# EAGLE schematic esp8266 (EAGLE 6.1)
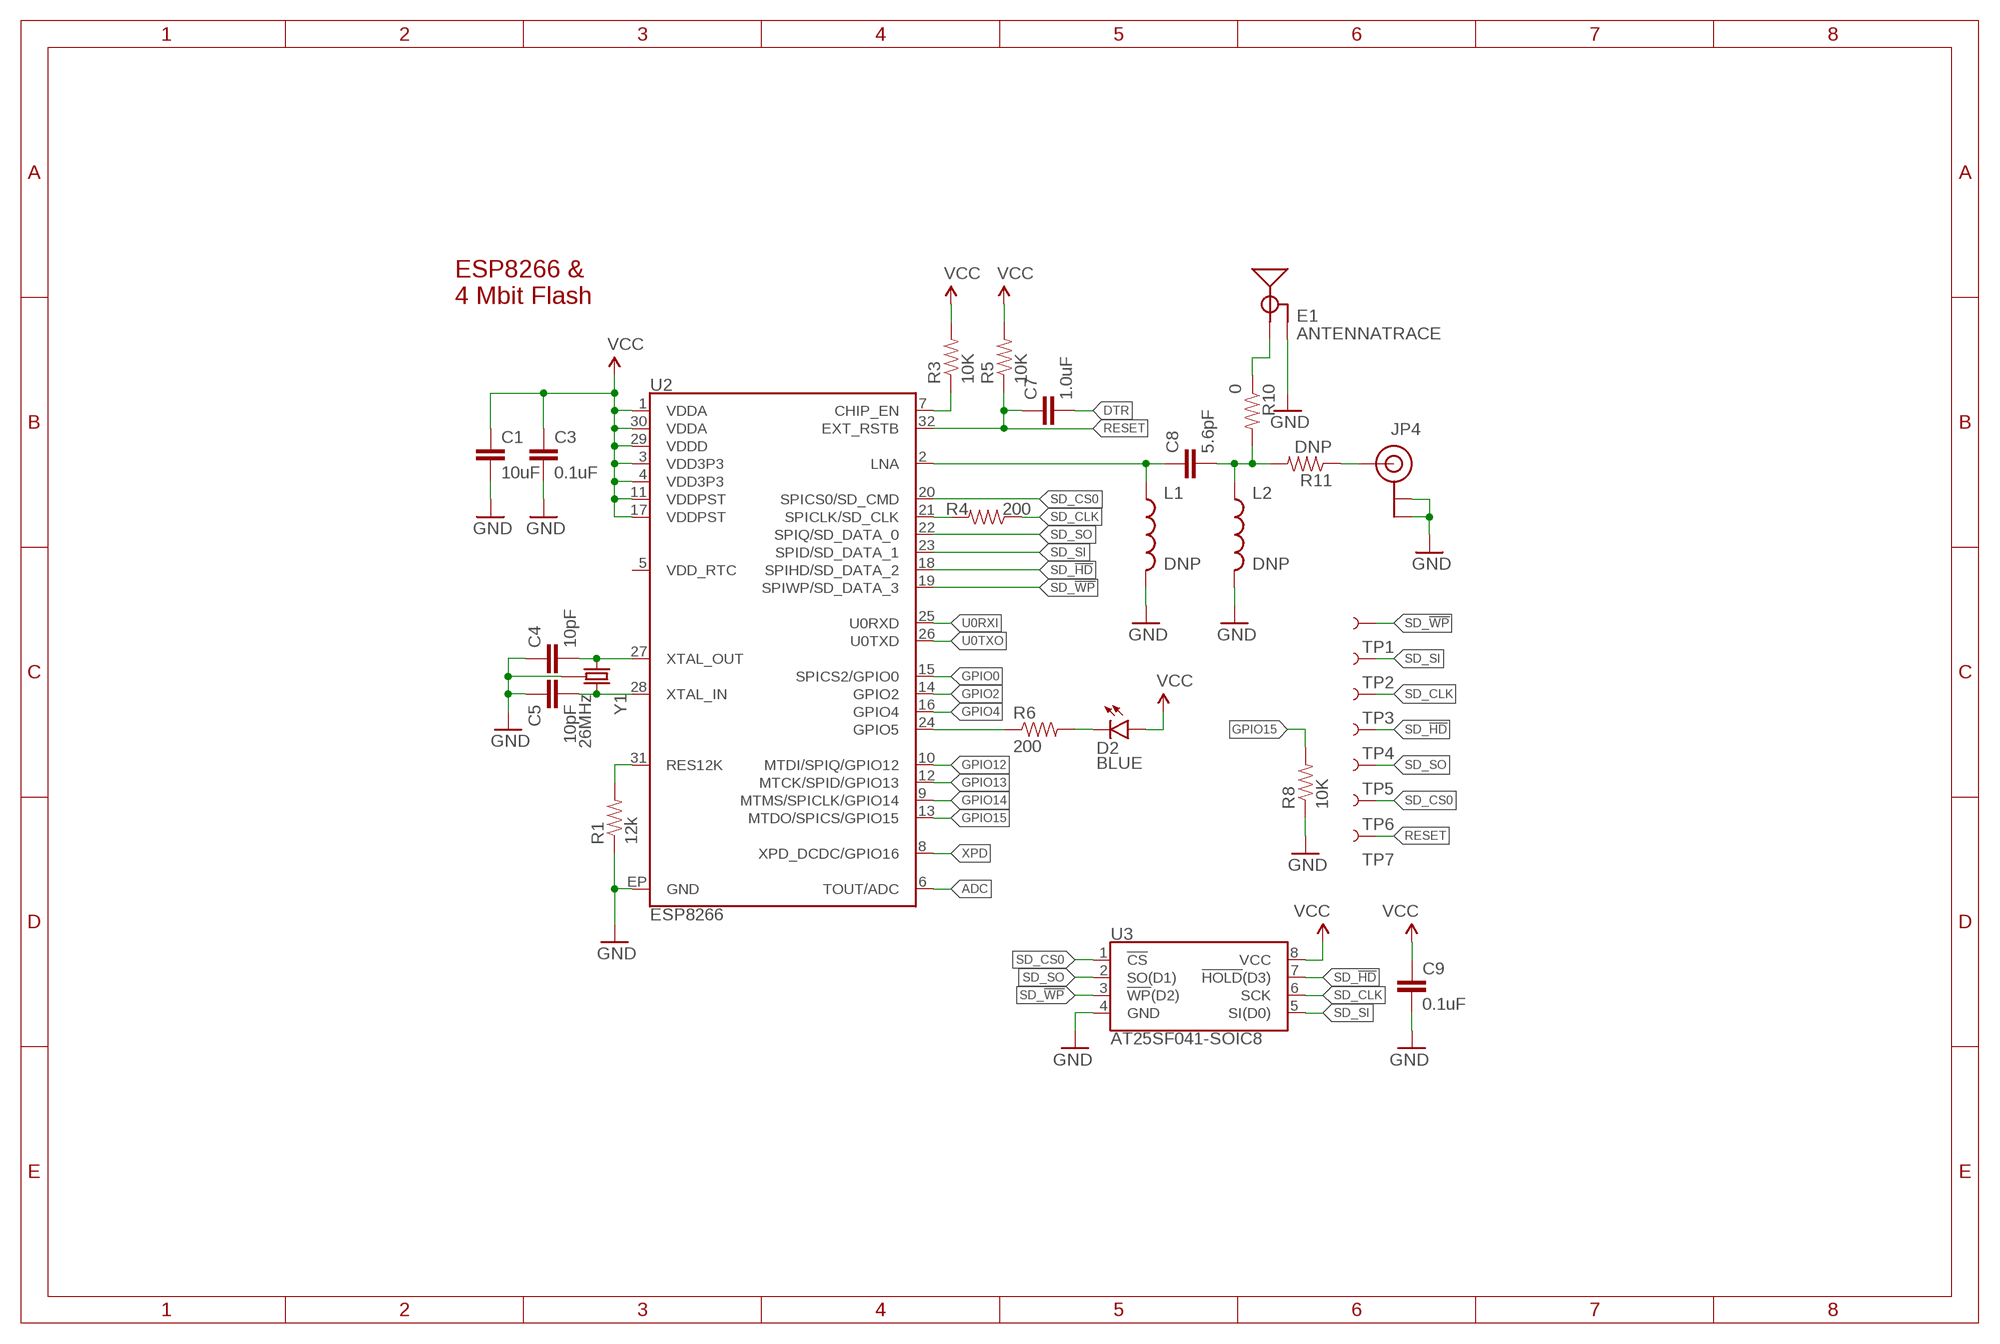
[diagram p0: schematic, sheet 1]

## Parts
C1  10uF  10UF-6.3V-20%(0603)  [0603-CAP]
C3  0.1uF  0.1UF-25V(+80/-20%)(0603)  [0603-CAP]
C4  10pF  10PF-50V-5%(0603)  [0603-CAP]
C5  10pF  10PF-50V-5%(0603)  [0603-CAP]
C7  1.0uF  1.0UF-16V-10%(0603)  [0603-CAP]
C8  5.6pF  CAP0603-CAP  [0603-CAP]
C9  0.1uF  0.1UF-25V(+80/-20%)(0603)  [0603-CAP]
D2  BLUE  LED-BLUE0603  [LED-0603]
E1  ANTENNATRACE  [TRACE_ANTENNA_2.4GHZ_25.7MM]
JP4  U.FL  [U.FL]
L1  DNP  INDUCTOR0603  [0603]
L2  DNP  INDUCTOR0603  [0603]
R1  12k  12KOHM-1/10W-1%(0603)  [0603-RES]
R3  10K  10KOHM1/10W1%(0603)0603  [0603-RES]
R4  200  200OHM1/10W1%(0603)  [0603-RES]
R5  10K  10KOHM1/10W1%(0603)0603  [0603-RES]
R6  200  200OHM1/10W1%(0603)  [0603-RES]
R8  10K  10KOHM1/10W1%(0603)0603  [0603-RES]
R10  0  0OHM1/10W5%(0603)  [0603]
R11  DNP  RESISTOR0603-RES  [0603-RES]
TP1  TEST-POINT3X5  [PAD.03X.05]
TP2  TEST-POINT3X5  [PAD.03X.05]
TP3  TEST-POINT3X5  [PAD.03X.05]
TP4  TEST-POINT3X5  [PAD.03X.05]
TP5  TEST-POINT3X5  [PAD.03X.05]
TP6  TEST-POINT3X5  [PAD.03X.05]
TP7  TEST-POINT3X5  [PAD.03X.05]
U2  ESP8266  [QFN32]
U3  AT25SF041-SOIC8  [SO08]
Y1  26MHz  CRYSTAL-GROUNDED3.2X2.5  [CRYSTAL-SMD-3.2X2.5]

## Nets
ADC: U2.6(TOUT/ADC)
ANT: JP4.P$3(SIGNAL) R11.1
CHIP_EN: R3.1 U2.7(CHIP_EN)
DTR: C7.2
GND: C1.2 C3.2 C4.1 C5.1 C9.2 E1.GND E1.GND2(GND) JP4.P$1(GND) JP4.P$2(GND) L1.2 L2.2 R1.1 R8.1 U2.EP(GND) U3.4(GND) Y1.2(GND) Y1.4(GND)
GPIO0: U2.15(SPICS2/GPIO0)
GPIO2: U2.14(GPIO2)
GPIO4: U2.16(GPIO4)
GPIO5: R6.1 U2.24(GPIO5)
GPIO12: U2.10(MTDI/SPIQ/GPIO12)
GPIO13: U2.12(MTCK/SPID/GPIO13)
GPIO14: U2.9(MTMS/SPICLK/GPIO14)
GPIO15: R8.2 U2.13(MTDO/SPICS/GPIO15)
LNA: C8.1 L1.1 U2.2(LNA)
N$1: R1.2 U2.31(RES12K)
N$2: C5.2 U2.28(XTAL_IN) Y1.3
N$3: C4.2 U2.27(XTAL_OUT) Y1.1
N$5: C8.2 L2.1 R10.2 R11.2
N$6: R4.2 U2.21(SPICLK/SD_CLK)
N$9: D2.C R6.2
RESET: C7.1 R5.1 TP7.P$1 U2.32(EXT_RSTB)
SD_!HD!: TP4.P$1 U2.18(SPIHD/SD_DATA_2) U3.7(!HOLD!(D3))
SD_!WP!: TP1.P$1 U2.19(SPIWP/SD_DATA_3) U3.3(!WP!(D2))
SD_CLK: R4.1 TP3.P$1 U3.6(SCK)
SD_CS0: TP6.P$1 U2.20(SPICS0/SD_CMD) U3.1(!CS!)
SD_SI: TP2.P$1 U2.23(SPID/SD_DATA_1) U3.5(SI(D0))
SD_SO: TP5.P$1 U2.22(SPIQ/SD_DATA_0) U3.2(SO(D1))
TRACE_ANT: E1.ANT(SIGNAL) R10.1
U0RXI: U2.25(U0RXD)
U0TXO: U2.26(U0TXD)
VCC: C1.1 C3.1 C9.1 D2.A R3.2 R5.2 U2.1(VDDA) U2.3(VDD3P3) U2.4(VDD3P3) U2.11(VDDPST) U2.17(VDDPST) U2.29(VDDD) U2.30(VDDA) U3.8(VCC)
XPD: U2.8(XPD_DCDC/GPIO16)
Unconnected: U2.5(VDD_RTC)

## Notes on the sheet
- ESP8266 &
  4 Mbit Flash

## Library data of the parts
C1 = SparkFun-Capacitors:10UF-6.3V-20%(0603): CAP-11015; PROD_ID: CAP-11015
C3 C9 = SparkFun-Capacitors:0.1UF-25V(+80/-20%)(0603): CAP-00810 Ceramic Standard decoupling cap; PROD_ID: CAP-00810
C4 C5 = SparkFun-Capacitors:10PF-50V-5%(0603): CAP-11812; PROD_ID: CAP-11812
C7 = SparkFun-Capacitors:1.0UF-16V-10%(0603): CAP-00868; PROD_ID: CAP-00868
C8 = SparkFun-Capacitors:CAP: Capacitor Standard 0603 ceramic capacitor, and 0.1" leaded capacitor.; PROD_ID: CAP-12456
D2 = SparkFun-LED:LED-BLUE: Blue LEDs for production use Various blue LEDs stocked by SparkFun production 0603 - DIO-08575 Rebel - DIO-09553 1206 - DIO-09911; PROD_ID: DIO-08575
E1 = esp8266-development-board:ANTENNA: Chip antenna Chip antenna with ground or secondary connection. Common with larger metal RF connectors.
JP4 = SparkFun-Connectors:U.FL: SMD antenna connector- WRL-09144; PROD_ID: CONN-09193
L1 L2 = SparkFun-Passives:INDUCTOR: Inductors Basic Inductor/Choke - 0603 and 1206. Footprints are not proven and vary greatly between part numbers. SRN6045- 33uH, 20% 1.4A SDR0403-560KL - 56uH, 10%, 500mA RMS/740mA peak
R1 = SparkFun-Resistors:12KOHM-1/10W-1%(0603): RES-10327; PROD_ID: RES-10327
R3 R5 R8 = SparkFun-Resistors:10KOHM1/10W1%(0603): RES-00824; PROD_ID: RES-00824
R4 R6 = SparkFun-Resistors:200OHM1/10W1%(0603): RES-08220; PROD_ID: RES-08220
R10 = SparkFun-Resistors:0OHM1/10W5%(0603): RES-08609; PROD_ID: RES-08609
R11 = SparkFun-Passives:RESISTOR: Resistor Basic schematic elements and footprints for 0603, 1206, and PTH resistors.
TP1-TP7 = SparkFun-Passives:TEST-POINT: Bare copper test points for troubleshooting or ICT
U2 = esp8266-development-board:ESP8266: Espressif ESP8266 WiFi Smart Connectivity Platform.; PROD_ID: IC-12452
U3 = esp8266-development-board:AT25SF041: SPI Serial Flash Memory with Dual/Quad-IO Support Example: Adesto Technologies AT25SF041-SSHD-T (1265-1131-1-ND) <http://www.digikey.com/product-detail/en/AT25SF041-SSHD-T/1265-1131-1-ND/4824165>; PROD_ID: IC-12455
Y1 = things:CRYSTAL-GROUNDED; PROD_ID: XTAL-12454